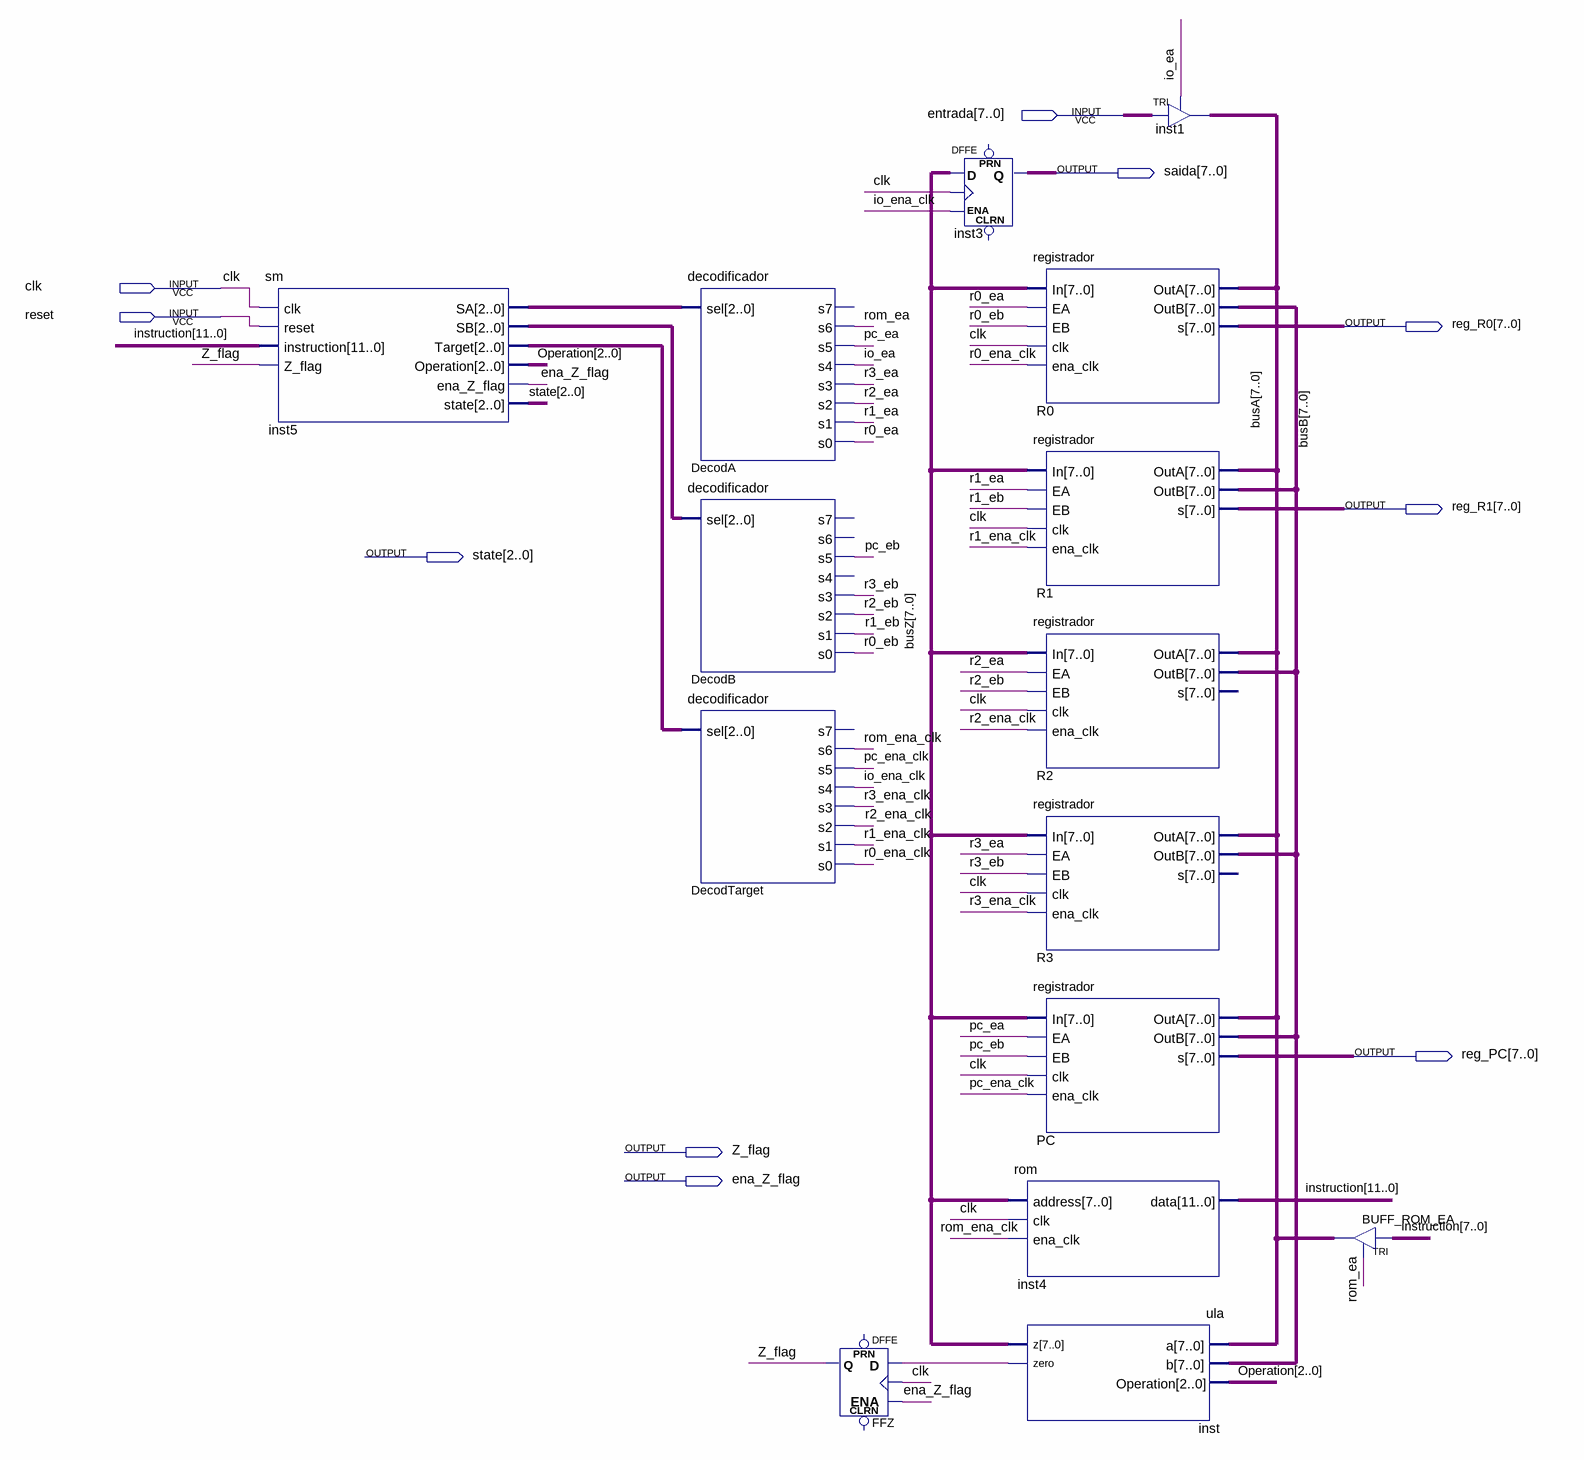
[diagram p0: schematic sheet]
// Quartus schematic planta.bdf as structural Verilog: 15 symbols, 10 pins
module planta (
  input  [7:0] entrada,
  input  clk,
  input  reset,
  output [7:0] saida,
  output [7:0] reg_R0,
  output [7:0] reg_R1,
  output [2:0] state,
  output [7:0] reg_PC,
  output Z_flag,
  output ena_Z_flag
);

  wire inst_zero, io_ea, io_ena_clk, pc_ea, pc_eb, pc_ena_clk, r0_ea, r0_eb, r0_ena_clk, r1_ea, r1_eb,
       r1_ena_clk, r2_ea, r2_eb, r2_ena_clk, r3_ea, r3_eb, r3_ena_clk, rom_ea, rom_ena_clk;
  wire [2:0] inst5_sa, inst5_sb, inst5_target, Operation;
  wire [7:0] busA, busB, busZ;
  wire [11:0] instruction;

  sm inst5 (
    .clk(clk), .reset(reset), .instruction(instruction), .Z_flag(Z_flag), .SA(inst5_sa), .SB(inst5_sb),
    .Target(inst5_target), .Operation(Operation), .ena_Z_flag(ena_Z_flag), .state(state));
  decodificador DecodA (
    .sel(inst5_sa), .s6(rom_ea), .s5(pc_ea), .s4(io_ea), .s3(r3_ea), .s2(r2_ea), .s1(r1_ea), .s0(r0_ea));  // open: s7
  decodificador DecodB (
    .sel(inst5_sb), .s5(pc_eb), .s3(r3_eb), .s2(r2_eb), .s1(r1_eb), .s0(r0_eb));  // open: s7, s6, s4
  decodificador DecodTarget (
    .sel(inst5_target), .s6(rom_ena_clk), .s5(pc_ena_clk), .s4(io_ena_clk), .s3(r3_ena_clk), .s2(r2_ena_clk),
    .s1(r1_ena_clk), .s0(r0_ena_clk));  // open: s7
  DFFE FFZ (.D(inst_zero), .CLK(clk), .ENA(ena_Z_flag), .Q(Z_flag));  // open: PRN, CLRN
  DFFE inst3[7:0] (.D(busZ), .CLK(clk), .ENA(io_ena_clk), .Q(saida));  // open: PRN, CLRN
  rom inst4 (.address(busZ), .clk(clk), .ena_clk(rom_ena_clk), .data(instruction));
  ula inst (.a(busA), .b(busB), .Operation(Operation), .z(busZ), .zero(inst_zero));
  registrador R0 (
    .In(busZ), .EA(r0_ea), .EB(r0_eb), .clk(clk), .ena_clk(r0_ena_clk), .s(reg_R0), .OutA(busA), .OutB(busB));
  registrador R1 (
    .In(busZ), .EA(r1_ea), .EB(r1_eb), .clk(clk), .ena_clk(r1_ena_clk), .s(reg_R1), .OutA(busA), .OutB(busB));
  registrador R2 (
    .In(busZ), .EA(r2_ea), .EB(r2_eb), .clk(clk), .ena_clk(r2_ena_clk), .OutA(busA), .OutB(busB));  // open: s
  registrador R3 (
    .In(busZ), .EA(r3_ea), .EB(r3_eb), .clk(clk), .ena_clk(r3_ena_clk), .OutA(busA), .OutB(busB));  // open: s
  registrador PC (
    .In(busZ), .EA(pc_ea), .EB(pc_eb), .clk(clk), .ena_clk(pc_ena_clk), .s(reg_PC), .OutA(busA), .OutB(busB));
  TRI inst1[7:0] (.IN(entrada), .OE(io_ea), .OUT(busA));
  TRI BUFF_ROM_EA[7:0] (.IN(instruction[7:0]), .OE(rom_ea), .OUT(busA));
endmodule
